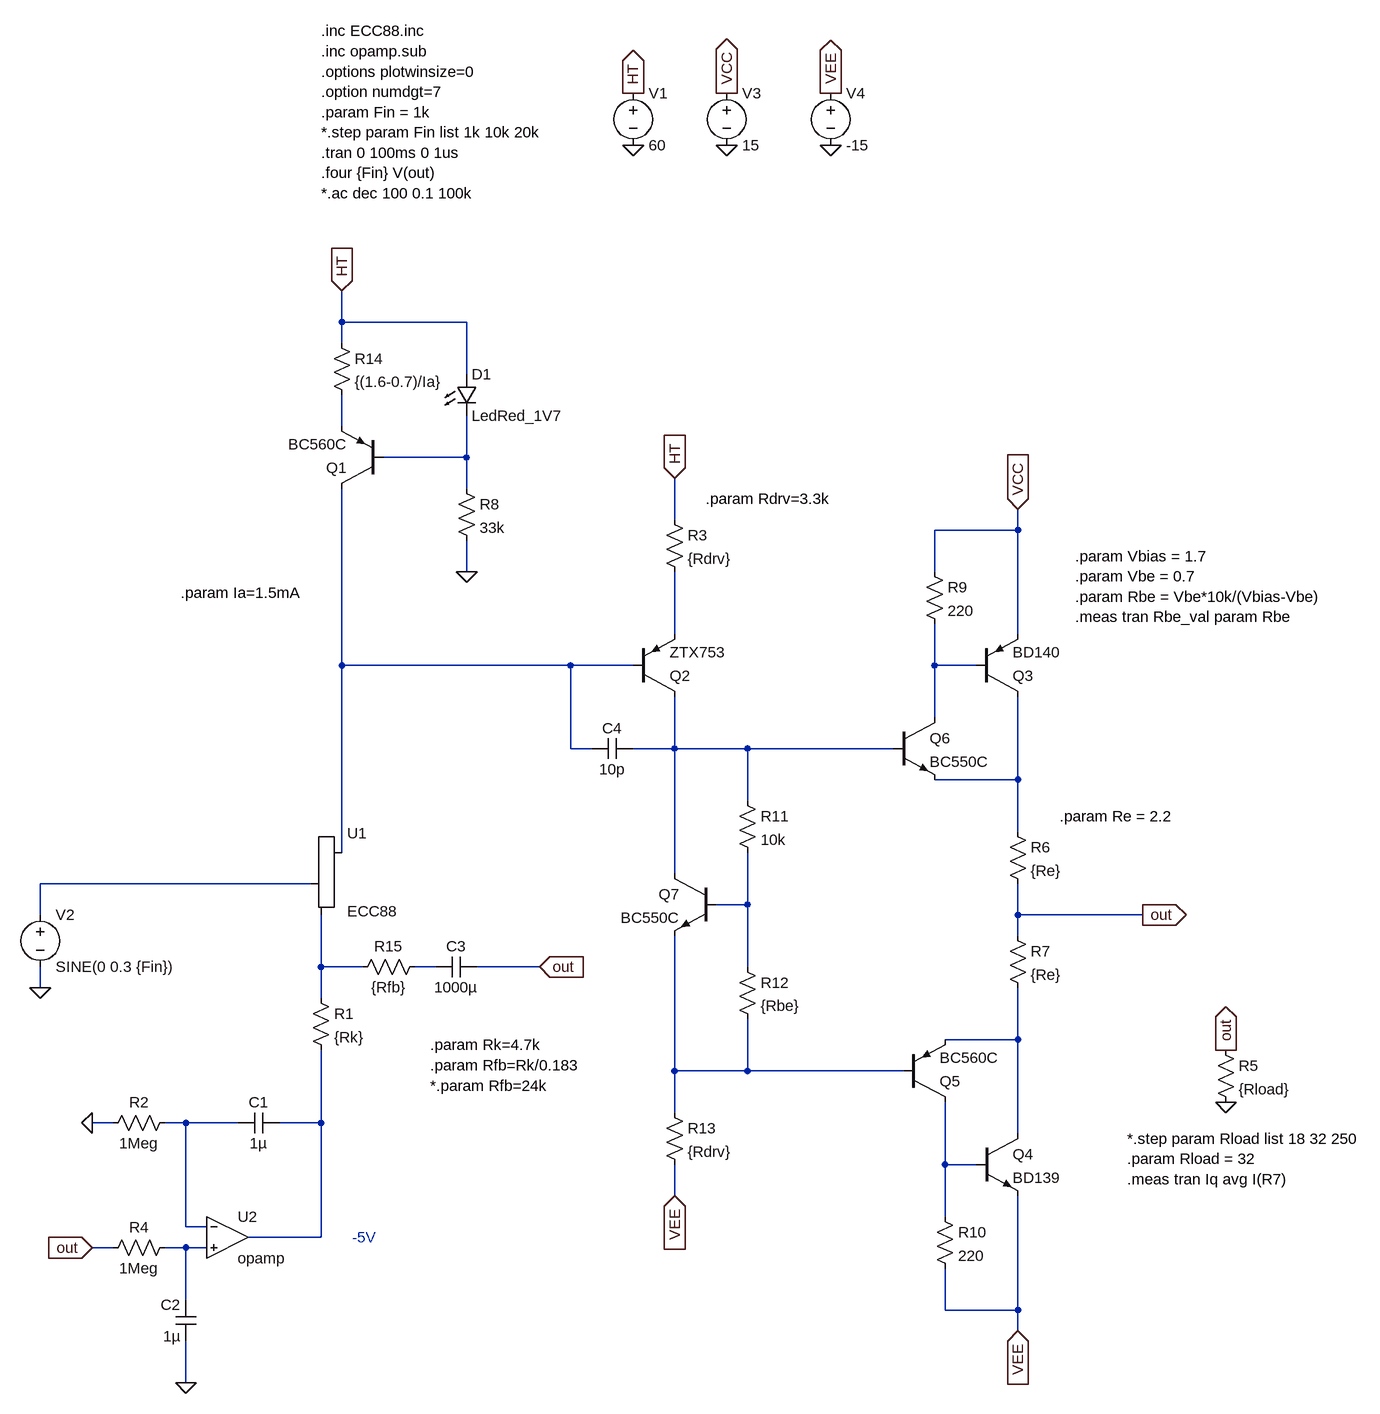
[diagram p0: schematic Hybrid 3.asc]
Hybrid 3.asc, the LTspice schematic file:
Version 4
SHEET 1 1560 1608
WIRE -160 -128 -160 -176
WIRE 32 -128 -160 -128
WIRE -160 -96 -160 -128
WIRE 32 -48 32 -128
WIRE -160 32 -160 -16
WIRE 32 80 32 16
WIRE 32 80 -96 80
WIRE 32 128 32 80
WIRE 352 176 352 112
WIRE 880 192 880 160
WIRE 880 192 752 192
WIRE 32 256 32 208
WIRE 752 256 752 192
WIRE 352 352 352 256
WIRE 880 352 880 192
WIRE -160 400 -160 128
WIRE 192 400 -160 400
WIRE 288 400 192 400
WIRE 752 400 752 336
WIRE 816 400 752 400
WIRE 752 480 752 400
WIRE 192 528 192 400
WIRE 224 528 192 528
WIRE 352 528 352 448
WIRE 352 528 288 528
WIRE 464 528 352 528
WIRE 688 528 464 528
WIRE 880 576 880 448
WIRE 880 576 752 576
WIRE 464 608 464 528
WIRE 880 656 880 576
WIRE -160 688 -160 400
WIRE 352 720 352 528
WIRE -208 736 -624 736
WIRE 464 768 464 688
WIRE 464 768 416 768
WIRE -624 784 -624 736
WIRE 880 784 880 736
WIRE 1072 784 880 784
WIRE 880 816 880 784
WIRE -192 864 -192 784
WIRE -128 864 -192 864
WIRE -16 864 -48 864
WIRE 144 864 48 864
WIRE 464 864 464 768
WIRE -624 896 -624 864
WIRE -192 912 -192 864
WIRE 880 976 880 896
WIRE 880 976 768 976
WIRE 352 1024 352 816
WIRE 464 1024 464 944
WIRE 464 1024 352 1024
WIRE 704 1024 464 1024
WIRE 352 1088 352 1024
WIRE -512 1104 -544 1104
WIRE -400 1104 -432 1104
WIRE -320 1104 -400 1104
WIRE -192 1104 -192 992
WIRE -192 1104 -256 1104
WIRE 880 1120 880 976
WIRE 768 1168 768 1072
WIRE 816 1168 768 1168
WIRE 352 1216 352 1168
WIRE 768 1248 768 1168
WIRE -400 1264 -400 1104
WIRE -368 1264 -400 1264
WIRE -192 1280 -192 1104
WIRE -192 1280 -304 1280
WIRE -512 1296 -544 1296
WIRE -400 1296 -432 1296
WIRE -368 1296 -400 1296
WIRE -400 1376 -400 1296
WIRE 768 1392 768 1328
WIRE 880 1392 880 1216
WIRE 880 1392 768 1392
WIRE 880 1424 880 1392
WIRE -400 1504 -400 1440
FLAG 288 -400 0
FLAG 288 -480 HT
IOPIN 288 -480 Out
FLAG 352 112 HT
IOPIN 352 112 In
FLAG 432 -400 0
FLAG 432 -480 VCC
IOPIN 432 -480 Out
FLAG 880 160 VCC
IOPIN 880 160 In
FLAG 1072 784 out
IOPIN 1072 784 Out
FLAG 1200 992 out
IOPIN 1200 992 Out
FLAG 1200 1072 0
FLAG 592 -400 0
FLAG 592 -480 VEE
IOPIN 592 -480 Out
FLAG 880 1424 VEE
IOPIN 880 1424 In
FLAG 352 1216 VEE
IOPIN 352 1216 In
FLAG -624 896 0
FLAG -544 1104 0
FLAG -160 -176 HT
IOPIN -160 -176 In
FLAG 32 256 0
FLAG 144 864 out
IOPIN 144 864 In
FLAG -544 1296 out
IOPIN -544 1296 In
FLAG -400 1504 0
SYMBOL voltage 288 -496 R0
SYMATTR InstName V1
SYMATTR Value 60
SYMBOL pnp 288 448 M180
SYMATTR InstName Q2
SYMATTR Value ZTX753
SYMBOL res 336 160 R0
SYMATTR InstName R3
SYMATTR Value {Rdrv}
SYMBOL voltage 432 -496 R0
SYMATTR InstName V3
SYMATTR Value 15
SYMBOL res 1184 976 R0
SYMATTR InstName R5
SYMATTR Value {Rload}
SYMBOL res 864 640 R0
SYMATTR InstName R6
SYMATTR Value {Re}
SYMBOL res 864 800 R0
SYMATTR InstName R7
SYMATTR Value {Re}
SYMBOL pnp 816 448 M180
SYMATTR InstName Q3
SYMATTR Value BD140
SYMBOL npn 816 1120 R0
SYMATTR InstName Q4
SYMATTR Value BD139
SYMBOL pnp 704 1072 M180
SYMATTR InstName Q5
SYMATTR Value BC560C
SYMBOL npn 688 480 R0
SYMATTR InstName Q6
SYMATTR Value BC550C
SYMBOL res 736 240 R0
SYMATTR InstName R9
SYMATTR Value 220
SYMBOL res 752 1232 R0
SYMATTR InstName R10
SYMATTR Value 220
SYMBOL npn 416 720 M0
SYMATTR InstName Q7
SYMATTR Value BC550C
SYMBOL res 448 592 R0
SYMATTR InstName R11
SYMATTR Value 10k
SYMBOL res 448 848 R0
SYMATTR InstName R12
SYMATTR Value {Rbe}
SYMBOL res 336 1072 R0
SYMATTR InstName R13
SYMATTR Value {Rdrv}
SYMBOL cap 288 512 R90
WINDOW 0 0 32 VBottom 2
WINDOW 3 32 32 VTop 2
SYMATTR InstName C4
SYMATTR Value 10p
SYMBOL voltage 592 -496 R0
SYMATTR InstName V4
SYMATTR Value -15
SYMBOL Misc/triode -160 736 R0
SYMATTR InstName U1
SYMATTR Value ECC88
SYMBOL voltage -624 768 R0
SYMATTR InstName V2
SYMATTR Value SINE(0 0.3 {Fin})
SYMATTR Value2 AC 1
SYMBOL res -208 896 R0
SYMATTR InstName R1
SYMATTR Value {Rk}
SYMBOL res -416 1088 R90
WINDOW 0 0 56 VBottom 2
WINDOW 3 32 56 VTop 2
SYMATTR InstName R2
SYMATTR Value 1Meg
SYMBOL res -416 1280 R90
WINDOW 0 0 56 VBottom 2
WINDOW 3 32 56 VTop 2
SYMATTR InstName R4
SYMATTR Value 1Meg
SYMBOL cap -256 1088 R90
WINDOW 0 0 32 VBottom 2
WINDOW 3 32 32 VTop 2
SYMATTR InstName C1
SYMATTR Value 1µ
SYMBOL pnp -96 128 R180
SYMATTR InstName Q1
SYMATTR Value BC560C
SYMBOL LED 16 -48 R0
SYMATTR InstName D1
SYMATTR Value LedRed_1V7
SYMBOL res 16 112 R0
SYMATTR InstName R8
SYMATTR Value 33k
SYMBOL res -176 -112 R0
SYMATTR InstName R14
SYMATTR Value {(1.6-0.7)/Ia}
SYMBOL res -32 848 R90
WINDOW 0 0 56 VBottom 2
WINDOW 3 32 56 VTop 2
SYMATTR InstName R15
SYMATTR Value {Rfb}
SYMBOL cap 48 848 R90
WINDOW 0 0 32 VBottom 2
WINDOW 3 32 32 VTop 2
SYMATTR InstName C3
SYMATTR Value 1000µ
SYMBOL cap -384 1440 R180
WINDOW 0 24 56 Left 2
WINDOW 3 24 8 Left 2
SYMATTR InstName C2
SYMATTR Value 1µ
SYMBOL Opamps/opamp -336 1216 R0
SYMATTR InstName U2
TEXT -192 -576 Left 2 !.inc ECC88.inc\n.inc opamp.sub\n.options plotwinsize=0\n.option numdgt=7\n.param Fin = 1k\n*.step param Fin list 1k 10k 20k\n.tran 0 100ms 0 1us\n.four {Fin} V(out)\n*.ac dec 100 0.1 100k
TEXT 1048 1128 Left 2 !*.step param Rload list 18 32 250\n.param Rload = 32\n.meas tran Iq avg I(R7)
TEXT 968 232 Left 2 !.param Vbias = 1.7\n.param Vbe = 0.7\n.param Rbe = Vbe*10k/(Vbias-Vbe)\n.meas tran Rbe_val param Rbe
TEXT 944 632 Left 2 !.param Re = 2.2
TEXT 400 144 Left 2 !.param Rdrv=3.3k
TEXT -408 288 Left 2 !.param Ia=1.5mA
TEXT -24 984 Left 2 !.param Rk=4.7k\n.param Rfb=Rk/0.183\n*.param Rfb=24k
TEXT -144 1280 Left 2 ;-5V

The netlist it stands for:
* Hybrid 3.asc
V1 HT 0 60
Q2 N006 N004 N003 0 ZTX753
R3 HT N003 {Rdrv}
V3 VCC 0 15
R5 out 0 {Rload}
R6 N007 out {Re}
R7 out N012 {Re}
Q3 N007 N005 VCC 0 BD140
Q4 N012 N016 VEE 0 BD139
Q5 N016 N013 N012 0 BC560C
Q6 N005 N006 N007 0 BC550C
R9 VCC N005 220
R10 N016 VEE 220
Q7 N006 N009 N013 0 BC550C
R11 N006 N009 10k
R12 N009 N013 {Rbe}
R13 N013 VEE {Rdrv}
C4 N006 N004 10p
V4 VEE 0 -15
XU1 N004 N008 N010 ECC88
V2 N008 0 SINE(0 0.3 {Fin}) AC 1
R1 N010 N015 {Rk}
R2 N014 0 1Meg
R4 N017 out 1Meg
C1 N015 N014 1µ
Q1 N004 N002 N001 0 BC560C
D1 HT N002 LedRed_1V7
R8 N002 0 33k
R14 HT N001 {(1.6-0.7)/Ia}
R15 N011 N010 {Rfb}
C3 out N011 1000µ
C2 0 N017 1µ
XU2 N014 N017 N015 opamp Aol=100K GBW=10Meg  ; pins invin noninvin out
.model D D
.lib standard.dio
.model NPN NPN
.model PNP PNP
.lib standard.bjt
.inc ECC88.inc
.inc opamp.sub
.options plotwinsize=0
.option numdgt=7
.param Fin = 1k
*.step param Fin list 1k 10k 20k
.tran 0 100ms 0 1us
.four {Fin} V(out)
*.ac dec 100 0.1 100k
*.step param Rload list 18 32 250
.param Rload = 32
.meas tran Iq avg I(R7)
.param Vbias = 1.7
.param Vbe = 0.7
.param Rbe = Vbe*10k/(Vbias-Vbe)
.meas tran Rbe_val param Rbe
.param Re = 2.2
.param Rdrv=3.3k
.param Ia=1.5mA
.param Rk=4.7k
.param Rfb=Rk/0.183
*.param Rfb=24k
* -5V
.backanno
.end